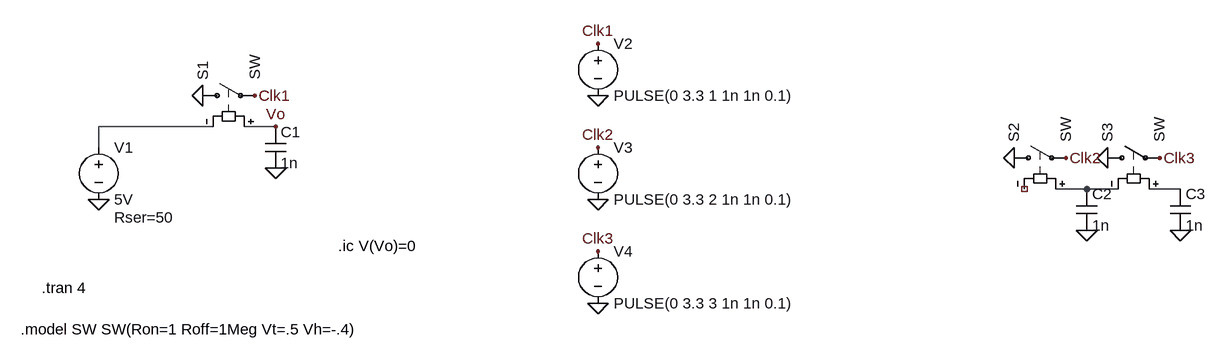
[diagram p0: schematic bucket_brigade.asc]
bucket_brigade.asc, the LTspice schematic file:
Version 4
SHEET 1 1368 680
WIRE -160 160 -336 160
WIRE -64 160 -112 160
WIRE -336 192 -336 160
WIRE 1184 256 1136 256
WIRE 1232 256 1184 256
WIRE 1328 256 1280 256
FLAG 1184 320 0
FLAG 1328 320 0
FLAG -64 224 0
FLAG -336 272 0
FLAG -176 112 0
FLAG 1072 208 0
FLAG 1216 208 0
FLAG -96 112 Clk1
FLAG 1152 208 Clk2
FLAG 1296 208 Clk3
FLAG 432 112 0
FLAG 432 272 0
FLAG 432 432 0
FLAG 432 32 Clk1
FLAG 432 192 Clk2
FLAG 432 352 Clk3
FLAG -64 160 Vo
SYMBOL cap -80 160 R0
SYMATTR InstName C1
SYMATTR Value 1n
SYMBOL cap 1168 256 R0
SYMATTR InstName C2
SYMATTR Value 1n
SYMBOL cap 1312 256 R0
SYMATTR InstName C3
SYMATTR Value 1n
SYMBOL sw 1056 208 R270
SYMATTR InstName S2
SYMBOL sw 1200 208 R270
SYMATTR InstName S3
SYMBOL sw -192 112 R270
SYMATTR InstName S1
SYMBOL voltage -336 176 R0
WINDOW 123 0 0 Left 0
WINDOW 39 24 124 Left 2
SYMATTR InstName V1
SYMATTR Value 5V
SYMATTR SpiceLine Rser=50
SYMBOL voltage 432 16 R0
WINDOW 123 0 0 Left 0
WINDOW 39 0 0 Left 0
SYMATTR InstName V2
SYMATTR Value PULSE(0 3.3 1 1n 1n 0.1)
SYMBOL voltage 432 176 R0
SYMATTR InstName V3
SYMATTR Value PULSE(0 3.3 2 1n 1n 0.1)
SYMBOL voltage 432 336 R0
SYMATTR InstName V4
SYMATTR Value PULSE(0 3.3 3 1n 1n 0.1)
TEXT -424 408 Left 2 !.tran 4
TEXT -456 472 Left 2 !.model SW SW(Ron=1 Roff=1Meg Vt=.5 Vh=-.4)
TEXT 32 344 Left 2 !.ic V(Vo)=0

The netlist it stands for:
* bucket_brigade.asc
C1 Vo 0 1n
C2 N002 0 1n
C3 N003 0 1n
S2 0 Clk2 N002 NC_01 SW
S3 0 Clk3 N003 N002 SW
S1 0 Clk1 Vo N001 SW
V1 N001 0 5V Rser=50
V2 Clk1 0 PULSE(0 3.3 1 1n 1n 0.1)
V3 Clk2 0 PULSE(0 3.3 2 1n 1n 0.1)
V4 Clk3 0 PULSE(0 3.3 3 1n 1n 0.1)
.tran 4
.model SW SW(Ron=1 Roff=1Meg Vt=.5 Vh=-.4)
.ic V(Vo)=0
.backanno
.end